# Altium schematic sheet Top level.SchDoc
size 431 x 279 mm; SheetNumber: 1; SheetTotal: 1
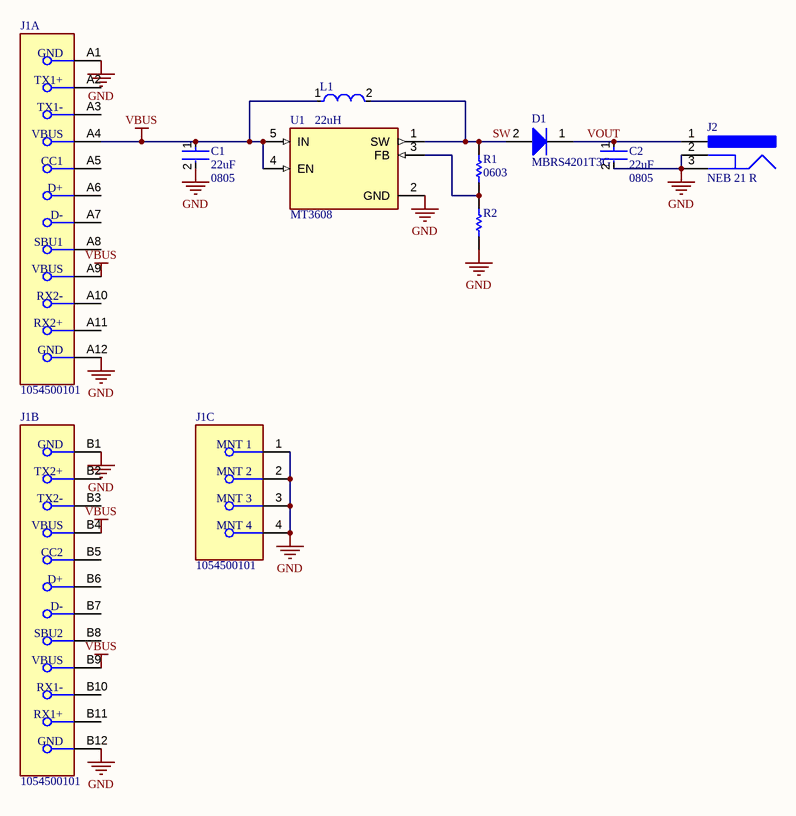
[diagram p0: Top level.SchDoc]

## Parts
C1  Capacitance: 22uF  Case Code (Imperial): 0805  [FP-GRM21B-0_15-MFG]  (hidden comment: GRM21BR60J226ME39L)
C2  Capacitance: 22uF  Case Code (Imperial): 0805  [FP-GRM21B-0_15-MFG]  (hidden comment: GRM21BR60J226ME39L)
D1  MBRS4201T3G  [ONSC-SMC-2-403-03_V]
J1  1054500101  [FP-1054500101-MFG]  (parts A,B,C of 3)
J2  NEB 21 R  [LUMB-NEB21R_V]
L1  Inductance: 22uH  [FP-IHLP-3232DZ-FP_2_413x5-MFG]  (hidden comment: IHLP3232DZER220M11)
R1  package: 0603  [RESC1608X55X30LL15T15]  (hidden comment: ERJ3EKF1802V)
R2  ERA3AEB162V  [RESC1608X55X30ML20T20]  (value not drawn)
U1  MT3608  [SOT95P280X145-6N]

## Nets
GND: C1.2 C2.2 J1.1(MNT_1) J1.2(MNT_2) J1.3(MNT_3) J1.4(MNT_4) J1.A1(GND) J1.A12(GND) J1.B1(GND) J1.B12(GND) J2.2 J2.3 R2.1 U1.2(GND)
VBUS: C1.1 J1.A4(VBUS) J1.A9(VBUS) J1.B4(VBUS) J1.B9(VBUS) L1.1 U1.4(EN) U1.5(IN)
SW: D1.2(A) L1.2 R1.2 U1.1(SW)
VOUT: C2.1 D1.1(K) J2.1
NetR1_1: R1.1 R2.2 U1.3(FB)

Not connected (* = marked no-connect by the designer): J1 A2(TX1+) A3(TX1-) A5(CC1) A6(D+) A7(D-) A8(SBU1) A10(RX2-) A11(RX2+) B2(TX2+) B3(TX2-) B5(CC2) B6(D+) B7(D-) B8(SBU2) B10(RX1-) B11(RX1+)

## Notes on the sheet
- DWG. NO.
- REV.
- SHT.
- THIS DOCUMENT AND THE DATA DISCLOSED HEREIN OR HEREWITH IS THE PROPERTY OF ALTIUM LIMITED AND MAY BE FREELY DISTRIBUTED IN WHOLE. NO RIGHTS ARE RESERVED OR EXPRESS OR IMPLIED WARANTEE GIVEN.
- REVISION
- DESCRIPTION
- DATE
- APPROVED
- ENG:
- APPROVALS
- PROJECT
- DSN:
- CHK:
- REFERENCE DOCUMENTS
- PROJECT REVISION:
- TITLE
- DOCUMENT REVISION:
- DESIGN ITEM:
- BOM:
- FAB DWG:
- PCB DWG:
- ASSY DWG:
- SCALE:
- SIZE
- B
- CAGE CODE
- FILE NAME
- DWG NO.
- SHEET
- OF
- REV

## Library data of the parts
C1 C2 = CMP-2007-03385-2: Chip Multilayer Ceramic Capacitors for General Purpose, 0805, 22uF, X5R, 15%, 20%, 6.3V; Material: Ceramic; Max Operating Temperature: 85°C; Voltage: 6.3V; Min Operating Temperature: -55°C; Case/Package: 0805; Thickness: 0.053inch; Dielectric: X5R; Packaging: Tape and Reel; Depth: 1.25mm; Termination: SMD/SMT; Voltage Rating (DC): 6.3V; Radiation Hardening: No; Tolerance: 20%; Mount: Surface Mount; Lead Free: Lead Free; Package Quantity: 1; REACH SVHC: No SVHC; Voltage Rating: 6.3V; Length: 2mm; Case Code (Metric): 2012; Width: 0.049inch; Height: 1.25mm; Value: 22uF
D1 = CMP-1051-00011-1: 200 V, 4 A Schottky Fast Soft-Recovery Power Rectifier, 2-Pin SMC, Pb-Free, Tape and Reel; Manufacturer: On Semiconductor; trr Max (ns): 35; Configuration: Single; IFSM Max (A): 100; ComponentLink1URL: http://www.onsemi.com/; PackageDescription: 2-Pin Small Molded Package, J-Bend Lead, Body 5.845 x 6.855 mm; PackageVersion: Rev. E, 08/2005; DatasheetVersion: Rev. 5; ComponentLink3Description: Package Specification; RoHS: TRUE; ComponentLink2Description: Datasheet; ComponentLink3URL: http://www.onsemi.com/pub_link/Collateral/403-03.PDF; Mounting Technology: Surface Mount; Packing: Tape and Reel; ComponentLink1Description: Manufacturer URL; ComponentLink2URL: http://www.onsemi.cn/pub_link/Collateral/MBRS4201T3-D.PDF; PartNumber: MBRS4201T3G; PackageReference: SMC-2-403-03
J1 = CMP-04767-000004-1: CONN RCP USB3.1 TYPEC 24P SMD RA; Manufacturer: Molex; Number Of Contacts: 24; Voltage Rating: 30V; Shielding: true; Is Female: yes; Current Rating: 0.25/1.25/5A; Pitch: 0.5mm; Conn Orientation: Right Angle; Package: 0; Height: 3.44mm; Footprint Url: https://www.molex.com/pdm_docs/sd/1054500101_sd.pdf; Device Class L1: Connectors; Category: Conn; Device Class L2: USB Connectors; Digikey Description: CONN RCP USB3.1 TYPEC 24P SMD RA; Contact Material: Gold,Nickel; Mouser Description: USB Shielded I/O Receptacle; Type C; Right Angle; Surface Mount; Gold over Nickel; ComponentLink2Description: Datasheet; Lead Free: Yes; Automotive: No; Temperature Range High: +85°C; RoHS: TRUE; Octopart: https://octopart.com/105450-0101-molex-68082325; ComponentLink2URL: https://www.molex.com/webdocs/datasheets/pdf/en-us/1054500101_IO_CONNECTORS.pdf; Temperature: -30°C to +85°C; Usb Standard: USB 3.1; Temperature Range Low: -30°C; Device Class L3: unset; Manufacturer Part Number: 1054500101
J2 = CMP-2000-06841-1: Jack Socket, Body 14.5 x 9 mm, Height 11 mm, -20 to 70 degC, 3-Pin THD, RoHS, Bulk; Manufacturer: Lumberg; Body Orientation: RightAngle; Voltage Rating: 12Vdc; Current Rating: 3A; Maximum Operating Temperature: +70°C; Mounting Technology: ThroughHole; Termination Method: Solder; Package Description: 3-Pin Through Hole Device, Body 14.5 x 9 mm, Height 11 mm; Datasheet URL: https://datasheet.ciiva.com/11720/0900766b805694d6-11720273.pdf; Datasheet Version: 12/2004; Package Reference: NEB21R; Manufacturer URL: http://www.lumberg.com/; Plug/Socket: Socket; Mounting Type: ThroughHole; Minimum Operating Temperature: -20°C
L1 = CMP-02424-000164-1: Commercial Inductors, Low DCR Series 22uH 4.3A 94.2mΩ 20%; Shielding: Shielded; Core Material: Metal; DC Resistance (DCR): 94.2mR; Test Frequency: 100kHz; Self Resonant Frequency: 8.2MHz; Max DC Current: 3.3A; Inductance Tolerance: 20%; Height: 4mm; Termination: SMD/SMT; Mount: Surface Mount; Radiation Hardening: No; Case/Package: 3232; Tolerance: 20%; Military Standard: Not; Min Operating Temperature: -55°C; Package Quantity: 1; Width: 0.322inch; Packaging: Tape and Reel; Number of Pins: 2; Lead Free: Lead Free; Max Operating Temperature: 125°C; RMS Current (Irms): 4.3A; Saturation Current: 3.3A; Height - Seated (Max): 0.157inch; Length: 8.64mm; Depth: 8.26mm; Current Rating: 4.3A; Value: 22uH
R1 = CMP-1012-00650-2: Manufacturer: Panasonic; Part Number: ERJ3EKF1802V
R2 = CMP-2000-00924-1: Manufacturer: Panasonic; Part Number: ERA3AEB162V
U1 = MT3608: High Efficiency 1.2MHz 2A Step Up Converter; MF: {'manufacturer': u'Aerosemi Technology Co., Ltd'}; Package: None; Availability: Unavailable; Value: *; MP: MT3608; Price: None